# Altium project MODULIQ_PGA.PrjPcb (part 1 of 2)
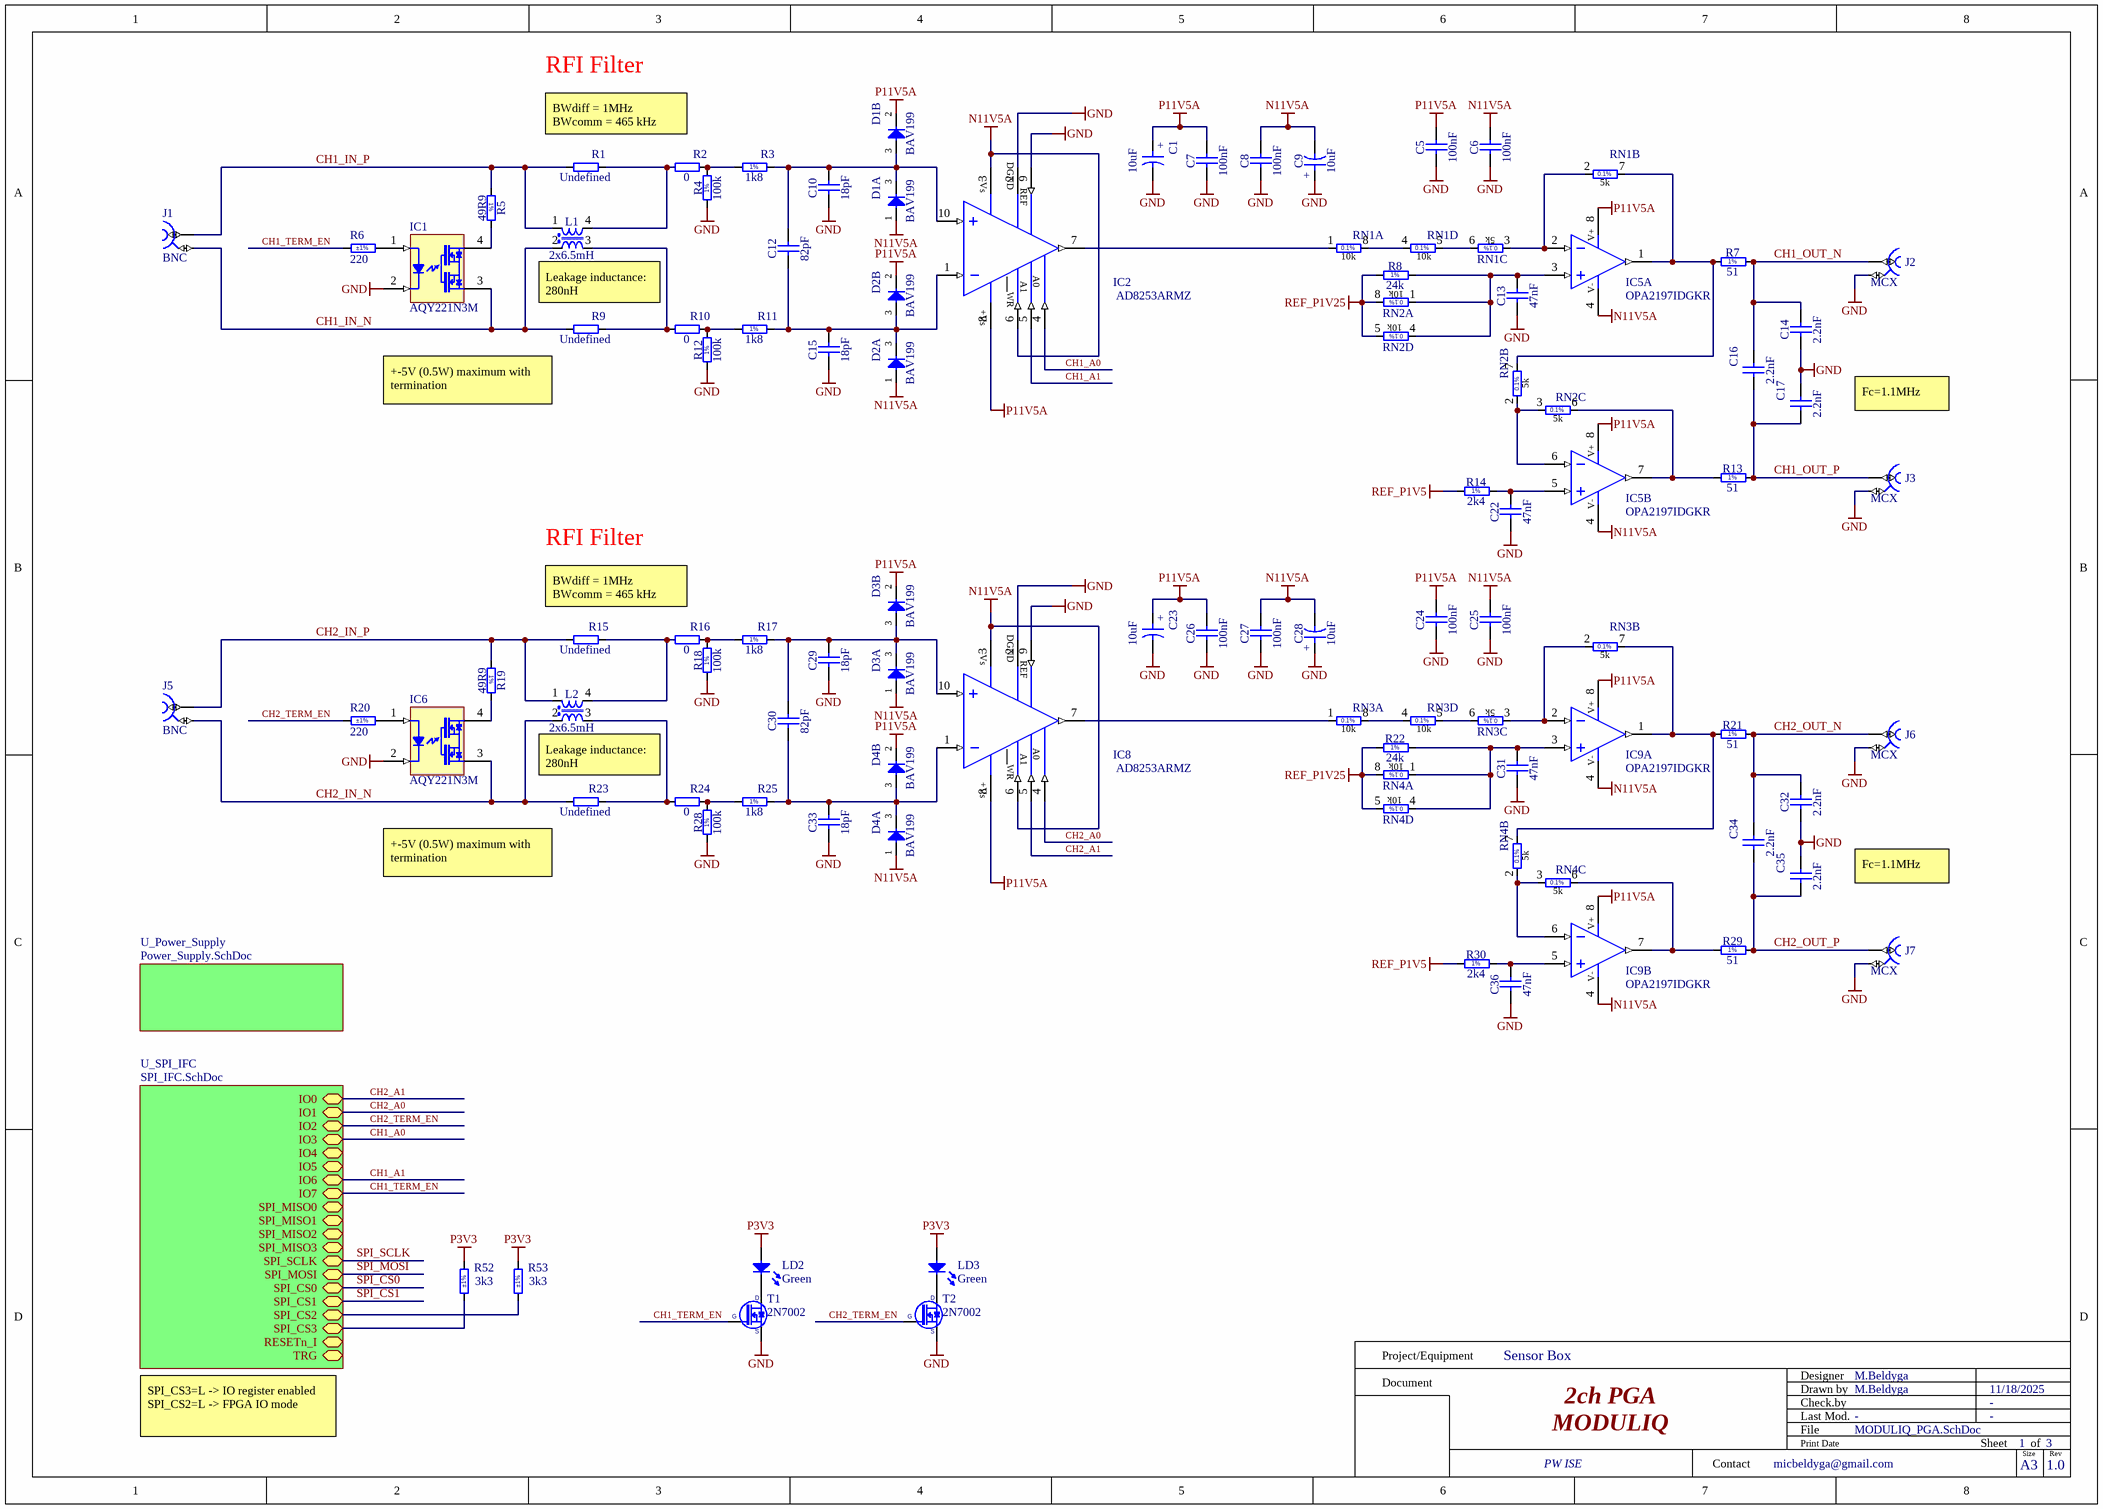
[diagram p0: MODULIQ_PGA.SchDoc]
Revision: 1.0; ProjectName: MODULIQ PGA; CreateDate: 11/18/2025
3 sheets, 187 parts. Net scope: hierarchical (ports join the sheet entries above them; power ports are global).
Board file: MODULIQ_PGA.PcbDoc
Sheets:
  MODULIQ_PGA.SchDoc
    U_SPI_IFC = SPI_IFC.SchDoc
    U_Power_Supply = Power_Supply.SchDoc

## Sheet MODULIQ_PGA.SchDoc: 2ch PGA
size A3; Author: M.Beldyga; CompanyName: WUT ISE; DrawnBy: M.Beldyga; Organization: WUT ISE; Address1: PW ISE; Address2: Nowowiejska 15/19 00-665 Warsaw; Address3: micbeldyga@gmail.com; SheetNumber: 1; SheetTotal: 3; ModifiedBy: -; CheckedDate: -; Title2: MODULIQ; DivGrp: WUT ISE; Designer: M.Beldyga; ModifiedDate: -; ProjectName: Sensor Box

### Parts
C1  10uF  [CAPMP3216X180N]
C5  100nF  [CAPC1005X55N]
C6  100nF  [CAPC1005X55N]
C7  100nF  [CAPC1005X55N]
C8  100nF  [CAPC1005X55N]
C9  10uF  [CAPMP3216X180N]
C10  18pF  [CAPC1608X87N]
C12  82pF  [CAPC2012X90N]
C13  47nF  [CAPC2012X135N]
C14  2.2nF  [CAPC2013X100N]
C15  18pF  [CAPC1608X87N]
C16  2.2nF  [CAPC2013X100N]
C17  2.2nF  [CAPC2013X100N]
C22  47nF  [CAPC2012X135N]
C23  10uF  [CAPMP3216X180N]
C24  100nF  [CAPC1005X55N]
C25  100nF  [CAPC1005X55N]
C26  100nF  [CAPC1005X55N]
C27  100nF  [CAPC1005X55N]
C28  10uF  [CAPMP3216X180N]
C29  18pF  [CAPC1608X87N]
C30  82pF  [CAPC2012X90N]
C31  47nF  [CAPC2012X135N]
C32  2.2nF  [CAPC2013X100N]
C33  18pF  [CAPC1608X87N]
C34  2.2nF  [CAPC2013X100N]
C35  2.2nF  [CAPC2013X100N]
C36  47nF  [CAPC2012X135N]
D1  BAV199  [SOT95P240X110-3N]  (parts A,B of 2)
D2  BAV199  [SOT95P240X110-3N]  (parts A,B of 2)
D3  BAV199  [SOT95P240X110-3N]  (parts A,B of 2)
D4  BAV199  [SOT95P240X110-3N]  (parts A,B of 2)
IC1  AQY221N3M  [PANASONIC_AQY22(SON)]
IC2  AD8253ARMZ  [SOP50P490X110-10N]
IC5  OPA2197IDGKR  [SOP65P490X110-8N]  (parts A,B of 2)
IC6  AQY221N3M  [PANASONIC_AQY22(SON)]
IC8  AD8253ARMZ  [SOP50P490X110-10N]
IC9  OPA2197IDGKR  [SOP65P490X110-8N]  (parts A,B of 2)
J1  BNC  [AMPHENOL_112515]
J2  MCX  [AMPHENOL_919-109J-51PX]
J3  MCX  [AMPHENOL_919-109J-51PX]
J5  BNC  [AMPHENOL_112515]
J6  MCX  [AMPHENOL_919-109J-51PX]
J7  MCX  [AMPHENOL_919-109J-51PX]
L1  2x6.5mH  [IND_WURTH_WE-SL2]
L2  2x6.5mH  [IND_WURTH_WE-SL2]
LD2  Green  [LED_KINGBRIGHT_KP-1608CGCK]
LD3  Green  [LED_KINGBRIGHT_KP-1608CGCK]
R1  Undefined  [RESC1608X55N]
R2  0  [RESC1608X55N]
R3  1k8  [RESC1608X55N]
R4  100k  [RESC1608X55N]
R5  49R9  [RESC6331X70N]
R6  220  Tolerance: ±1%  [RESC1005X40N]
R7  51  [RESC1005X40N]
R8  24k  [RESC1608X55N]
R9  Undefined  [RESC1608X55N]
R10  0  [RESC1608X55N]
R11  1k8  [RESC1608X55N]
R12  100k  [RESC1608X55N]
R13  51  [RESC1005X40N]
R14  2k4  [RESC1005X40N]
R15  Undefined  [RESC1608X55N]
R16  0  [RESC1608X55N]
R17  1k8  [RESC1608X55N]
R18  100k  [RESC1608X55N]
R19  49R9  [RESC6331X70N]
R20  220  Tolerance: ±1%  [RESC1005X40N]
R21  51  [RESC1005X40N]
R22  24k  [RESC1608X55N]
R23  Undefined  [RESC1608X55N]
R24  0  [RESC1608X55N]
R25  1k8  [RESC1608X55N]
R28  100k  [RESC1608X55N]
R29  51  [RESC1005X40N]
R30  2k4  [RESC1005X40N]
R52  3k3  Tolerance: ±1%  [RESC1005X40N]
R53  3k3  Tolerance: ±1%  [RESC1005X40N]
RN1  10k 5K 5K 10K  [SOIC127P600X175-8N]  (value not drawn)  (parts A,B,C,D of 4)
RN2  10k 5K 5K 10K  [SOIC127P600X175-8N]  (value not drawn)  (parts A,B,C,D of 4)
RN3  10k 5K 5K 10K  [SOIC127P600X175-8N]  (value not drawn)  (parts A,B,C,D of 4)
RN4  10k 5K 5K 10K  [SOIC127P600X175-8N]  (value not drawn)  (parts A,B,C,D of 4)
T1  2N7002  [SOT95P240X130-3N]
T2  2N7002  [SOT95P240X130-3N]

### Sub-sheets
U_Power_Supply = Power_Supply.SchDoc: no entries
U_SPI_IFC = SPI_IFC.SchDoc: IO0 (bidir), IO1 (bidir), IO2 (bidir), IO3 (bidir), IO4 (bidir), IO5 (bidir), IO6 (bidir), IO7 (bidir), SPI_MISO0 (bidir), SPI_MISO1 (bidir), SPI_MISO2 (bidir), SPI_MISO3 (bidir), SPI_SCLK (bidir), SPI_MOSI (bidir), SPI_CS0 (bidir), SPI_CS1 (bidir), SPI_CS2 (bidir), SPI_CS3 (bidir), RESETn_I (bidir), TRG (bidir)

### Nets
GND: C1.2 C5.1 C6.1 C7.1 C8.1 C9.1 C10.1 C13.1 C14.1 C15.1 C17.2 C22.1 C23.2 C24.1 C25.1 C26.1 C27.1 C28.1 C29.1 C31.1 C32.1 C33.1 C35.2 C36.1 IC1.2(K) IC2.2(DGND) IC2.9(REF) IC6.2(K) IC8.2(DGND) IC8.9(REF) J2.2 J3.2 J6.2 J7.2 R4.1 R12.1 R18.1 R28.1 T1.2(S) T2.2(S)
N11V5A: C6.2 C8.2 C9.2 C25.2 C27.2 C28.2 D1.1(A) D2.1(A) D3.1(A) D4.1(A) IC2.3(-VS) IC2.6(~{WR}) IC5.4(V-) IC8.3(-VS) IC8.6(~{WR}) IC9.4(V-)
P3V3: LD2.2(A) LD3.2(A) R52.1 R53.1
P11V5A: C1.1 C5.2 C7.2 C23.1 C24.2 C26.2 D1.2(C) D2.2(C) D3.2(C) D4.2(C) IC2.8(+VS) IC5.8(V+) IC8.8(+VS) IC9.8(V+)
REF_P1V5: R14.1 R30.1
REF_P1V25: R8.1 R22.1 RN2.5 RN2.8 RN4.5 RN4.8
CH1_A0: IC2.4(A0) ; sheet U_SPI_IFC/IO3
CH1_A1: IC2.5(A1) ; sheet U_SPI_IFC/IO6
CH1_IN_N: IC1.3(C) J1.2 L1.2 R9.1
CH1_IN_P: J1.1 L1.1 R1.1 R5.1
CH1_OUT_N: C14.2 C16.2 J2.1 R7.2
CH1_OUT_P: C16.1 C17.1 J3.1 R13.2
CH1_TERM_EN: R6.1 T1.1(G) ; sheet U_SPI_IFC/IO7
CH2_A0: IC8.4(A0) ; sheet U_SPI_IFC/IO1
CH2_A1: IC8.5(A1) ; sheet U_SPI_IFC/IO0
CH2_IN_N: IC6.3(C) J5.2 L2.2 R23.1
CH2_IN_P: J5.1 L2.1 R15.1 R19.1
CH2_OUT_N: C32.2 C34.2 J6.1 R21.2
CH2_OUT_P: C34.1 C35.1 J7.1 R29.2
CH2_TERM_EN: R20.1 T2.1(G) ; sheet U_SPI_IFC/IO2
SPI_CS2: R53.2 ; sheet U_SPI_IFC/SPI_CS2
SPI_CS3: R52.2 ; sheet U_SPI_IFC/SPI_CS3
NetC10_2: C10.2 C12.2 D1.3(COMAC) IC2.10(+IN) R3.2
NetC12_1: C12.1 C15.2 D2.3(COMAC) IC2.1(-IN) R11.2
NetC13_2: C13.2 IC5.3(IN+) R8.2 RN2.1 RN2.4
NetC22_2: C22.2 IC5.5(IN+) R14.2
NetC29_2: C29.2 C30.2 D3.3(COMAC) IC8.10(+IN) R17.2
NetC30_1: C30.1 C33.2 D4.3(COMAC) IC8.1(-IN) R25.2
NetC31_2: C31.2 IC9.3(IN+) R22.2 RN4.1 RN4.4
NetC36_2: C36.2 IC9.5(IN+) R30.2
NetIC1_1: IC1.1(A) R6.2
NetIC1_4: IC1.4(E) R5.2
NetIC2_7: IC2.7(OUT) RN1.1
NetIC5_1: IC5.1(OUT) R7.1 RN1.7 RN2.7
NetIC5_2: IC5.2(IN-) RN1.2 RN1.3
NetIC5_6: IC5.6(IN-) RN2.2 RN2.3
NetIC5_7: IC5.7(OUT) R13.1 RN2.6
NetIC6_1: IC6.1(A) R20.2
NetIC6_4: IC6.4(E) R19.2
NetIC8_7: IC8.7(OUT) RN3.1
NetIC9_1: IC9.1(OUT) R21.1 RN3.7 RN4.7
NetIC9_2: IC9.2(IN-) RN3.2 RN3.3
NetIC9_6: IC9.6(IN-) RN4.2 RN4.3
NetIC9_7: IC9.7(OUT) R29.1 RN4.6
NetL1_3: L1.3 R9.2 R10.1
NetL1_4: L1.4 R1.2 R2.1
NetL2_3: L2.3 R23.2 R24.1
NetL2_4: L2.4 R15.2 R16.1
NetLD2_1: LD2.1(C) T1.3(D)
NetLD3_1: LD3.1(C) T2.3(D)
NetR2_2: R2.2 R3.1 R4.2
NetR10_2: R10.2 R11.1 R12.2
NetR16_2: R16.2 R17.1 R18.2
NetR24_2: R24.2 R25.1 R28.2
NetRN1_4: RN1.4 RN1.8
NetRN1_5: RN1.5 RN1.6
NetRN3_4: RN3.4 RN3.8
NetRN3_5: RN3.5 RN3.6

### Notes on the sheet
- RFI Filter
- BWdiff = 1MHz
  BWcomm = 465 kHz
- (near L1) Leakage inductance: 280nH
- (near R9) +-5V (0.5W) maximum with termination
- Fc=1.1MHz
- (near L2) Leakage inductance: 280nH
- (near R23) +-5V (0.5W) maximum with termination
- SPI_CS3=L -> IO register enabled
  SPI_CS2=L -> FPGA IO mode
- Project/Equipment
- Document
- Designer
- Drawn by
- Check.by
- Contact
- File
- Last Mod.
- Print Date
- Sheet
- Size
- A3
- of
- Rev
- (in symbol AD8253ARMZ) -Vs; WR; +Vs
- (in symbol CTE3216-18_10UF_16V_20%_AVX_TCJ) +
- (in symbol R0402_2K4_1%_0.0625W_100PPM) 1%
- (in symbol R0402_51R_1%_0.0625W_100PPM) 1%
- (in symbol R0603_1K8_1%_0.1W_100PPM) 1%
- (in symbol R0603_24K_1%_0.1W_100PPM) 1%
- (in symbol R0603_100K_1%_0.1W_100PPM) 1%
- (in symbol R2512_49R9_1%_1W_100PPM_VISHAY_CRCW) 1%
- (in symbol RN_10K_5K_VISHAY_AORN2-1AT3, part A) 10k
- (in symbol RN_10K_5K_VISHAY_AORN2-1AT3, part B) 5k
- (in symbol RN_10K_5K_VISHAY_AORN2-1AT3, part C) 5k
- (in symbol RN_10K_5K_VISHAY_AORN2-1AT3, part D) 10k

### Library data of the parts
C1 C9 C23 C28 = CTE3216-18_10UF_16V_20%_AVX_TCJ: Polarised capacitor; Part Description: ESR 0R200 Tantalum Solid Electrolytic Chip Capacitor with Conductive Polymer Electrode; Manufacturer: AVX; Manufacturer Part Number: TCJA106M016R0200; Voltage: 16V; Tolerance: ±20%; Part Number: CTE3216-18_10UF_16V_20%_AVX_TCJ; Component Kind: Standard; Component Type: Standard; Pin Count: 2; Value: 10uF; Status: Preferred; Case: A; Mounted: Yes; Socket: No; SMD: Yes; Sense: No; ComponentHeight: 1.8mm; HelpURL: \\cern.ch\dfs\Applications\Altium\Datasheets\CTE_AVX_TCJ.pdf; Author: CERN DEM JLC; CreateDate: 29.03.2012; LatestRevisionDate: 29.03.2012
C5-C8 C24-C27 = CC0402_100NF_50V_10%_X7R: Non-polarised capacitor; Part Description: SMD Multilayer Chip Ceramic Capacitor; Manufacturer: GENERIC; Manufacturer1 Part Number: GRM155R71H104KE14D; Voltage: 50V; TC: X7R; Tolerance: ±10%; Part Number: CC0402_100NF_50V_10%_X7R; Component Kind: Standard; Component Type: Standard; Pin Count: 2; Value: 100nF; Status: None; Manufacturer Part Number: CC0402_100NF_50V_10%_X7R; Case: 0402; Mounted: Yes; Socket: No; SMD: Yes; Sense: No; Manufacturer1 Example: MURATA; Manufacturer1 ComponentHeight: 0.55mm; HelpURL: \\cern.ch\dfs\Applications\Altium\Datasheets\CC0402_MURATA_GRM155R71H104KE14D.pdf; Author: CERN DEM MR; CreateDate: 6/30/2017; LatestRevisionDate: 6/30/2017
C10 C15 C29 C33 = CC0603_18PF_50V_5%_NP0: Non-polarised capacitor; Part Description: SMD Multilayer Chip Ceramic Capacitor; Manufacturer: GENERIC; Manufacturer1 Part Number: 223886715189; Voltage: 50V; TC: C0G/NP0; Tolerance: ±5%; Part Number: CC0603_18PF_50V_5%_NP0; Component Kind: Standard; Component Type: Standard; Pin Count: 2; Value: 18pF; Status: Preferred; Manufacturer Part Number: CC0603_18PF_50V_5%_NP0; Case: 0603; Mounted: Yes; Socket: No; SMD: Yes; Sense: No; Manufacturer1 Example: PHYCOMP; Manufacturer1 ComponentHeight: 0.87mm; HelpURL: \\cern.ch\dfs\Applications\Altium\Datasheets\CC0603_NP0_PHYCOMP.pdf; Author: CERN DEM JLC; CreateDate: 03.12.2007; LatestRevisionDate: 03.12.2007
C12 C30 = CC0805_82PF_100V_1%_NP0_AVX_08051A820FAT2A: Non-polarised capacitor; Part Description: SMD Multilayer Chip Ceramic Capacitor; Manufacturer: AVX; Voltage: 100V; TC: NP0; Tolerance: ±1%; Part Number: CC0805_82PF_100V_1%_NP0_AVX_08051A820FAT2A; Component Kind: Standard; Component Type: Standard; Pin Count: 2; Value: 82pF; Status: Not Recommended; Manufacturer Part Number: 08051A820FAT2A; Case: 0805; Mounted: Yes; Socket: No; SMD: Yes; Sense: No; ComponentHeight: 0.9mm; HelpURL: \\cern.ch\dfs\Applications\Altium\Datasheets\CC0805_C0G_AVX.pdf; Author: CERN DEM WB; CreateDate: 26.07.2016; LatestRevisionDate: 26.07.2016
C13 C22 C31 C36 = CC0805_47NF_25V_5%_C0G: Non-polarised capacitor; Part Description: SMD Multilayer Chip Ceramic Capacitor; Manufacturer: GENERIC; Manufacturer1 Part Number: C0805C473J3GACTU; Voltage: 25V; TC: C0G/NP0; Tolerance: ±5%; Part Number: CC0805_47NF_25V_5%_C0G; Component Kind: Standard; Component Type: Standard; Pin Count: 2; Value: 47nF; Status: None; Manufacturer Part Number: CC0805_47NF_25V_5%_C0G; Case: 0805; Mounted: Yes; Socket: No; SMD: Yes; Sense: No; Manufacturer1 Example: KEMET; Manufacturer1 ComponentHeight: 1.4mm; HelpURL: \\cern.ch\dfs\Applications\Altium\Datasheets\CC0805_C0G_KEMET_(Commercial Grade).pdf; Author: CERN DEM JLC; CreateDate: 18.01.2011; LatestRevisionDate: 18.01.2011
C14 C16 C17 C32 C34 C35 = CC0805_2.2NF_25V_1%_C0G: Non-polarised capacitor; Part Description: SMD Multilayer Chip Ceramic Capacitor; Manufacturer: GENERIC; Manufacturer1 Part Number: C0805C222F3GACTU; Voltage: 25V; TC: C0G/NP0; Tolerance: ±1%; Part Number: CC0805_2.2NF_25V_1%_C0G; Component Kind: Standard; Component Type: Standard; Pin Count: 2; Value: 2.2nF; Status: None; Manufacturer Part Number: CC0805_2.2NF_25V_1%_C0G; Case: 0805; Mounted: Yes; Socket: No; SMD: Yes; Sense: No; Manufacturer1 Example: KEMET; Manufacturer1 ComponentHeight: 0.88mm; HelpURL: \\cern.ch\dfs\Applications\Altium\Datasheets\CC0805_C0G_KEMET_(Commercial Grade).pdf; Author: CERN DEM JLC; CreateDate: 11.03.2015; LatestRevisionDate: 11.03.2015
D1-D4 = BAV199: Serial Diode; Part Description: Low-Leakage Double Diode; Manufacturer: NXP SEMICONDUCTORS; Voltage: 75V; Power: 250mW; PressFit: No; Bonding: No; Part Number: BAV199; Component Kind: Standard; Component Type: Standard; Device: BAV199; PackageDescription: SOT23 3-Leads, Pitch 0.95mm - Body 1.4x3mm, IPC Medium Density; Manufacturer Part Number: BAV199; Pin Count: 3; Case: SOT23-3; Mounted: Yes; Socket: No; SMD: Yes; Sense: No; ComponentHeight: 1.1mm; HelpURL: \\cern.ch\dfs\Applications\Altium\Datasheets\BAV199.pdf; Author: CERN DEM JMW; CreateDate: 2008-11-21; LatestRevisionDate: 2008-11-21
IC1 IC6 = AQY221N3M: PhotoMOS Relay; Part Description: RF SON 1 Form A, PhotoMOS Relay, CxR5 (On Res. 5.5Ohm, Out Cap. 1.1pF), 25V 150mA; Manufacturer: PANASONIC; PressFit: No; Bonding: No; Part Number: AQY221N3M; Component Kind: Standard; Component Type: Standard; Device: AQY221N3M; PackageDescription: PANASONIC Serie AQY22(SON), 1.27mm Pitch; 4 Pin, 2.95mm W X 2.20mm L X 1.60mm H body; Manufacturer Part Number: AQY221N3M; Pin Count: 4; Case: SON4; Mounted: Yes; Socket: No; SMD: Yes; Sense: No; ComponentHeight: 1.4mm; HelpURL: \\cern.ch\dfs\Applications\Altium\Datasheets\AQY221N3M.pdf; ComponentLink1Description: Package Drawing; ComponentLink1URL: \\cern.ch\dfs\Applications\Altium\Datasheets\AQY22_Package-Drawing.pdf; Author: CERN DEM JLC; CreateDate: 1/18/2010; LatestRevisionDate: 12/5/2018
IC2 IC8 = AD8253ARMZ: 10MHz, 20V/us, G= 1, 10, 100, 1000 iCMOS Programmable Gain Instrumentation Amplifier; Manufacturer: ANALOG DEVICES; PressFit: No; Bonding: No; Part Number: AD8253ARMZ; Component Kind: Standard; Component Type: Standard; Device: AD8253ARMZ; PackageDescription: MSOP, 10-Leads, Body 3.1x3.1mm (max), Pitch 0.50mm, IPC Medium Density; Part Description: 10MHz, 20V/us, G= 1, 10, 100, 1000 iCMOS Programmable Gain Instrumentation Amplifier; Manufacturer Part Number: AD8253ARMZ; Pin Count: 8; Case: MSOP10; Mounted: Yes; Socket: No; SMD: Yes; Sense: No; ComponentHeight: 1.1mm; Author: CERN DEM JLC; HelpURL: \\cern.ch\dfs\Applications\Altium\Datasheets\AD8253ARMZ.pdf; CreateDate: 2013-10-02; LatestRevisionDate: 2013-10-02
IC5 IC9 = OA_OPA2197IDGKR: 36-V, Precision, Rail-to-Rail Input Output, Low Offset Voltage Op Amp 8-VSSOP; Part Description: High-Precision, Low-Noise, Rail-to-Rail Output,10-MHz Op Amp; Manufacturer: TEXAS INSTRUMENTS; PressFit: No; Bonding: No; Part Number: OPA2197IDGKR; Component Kind: Standard; Component Type: Standard; Device: OPA2197IDGKR; PackageDescription: SOP, 0.65mm pitch; 8 pin, 3.00mm W X 3.00mm L X 1.10mm H body, IPC Medium Density; Manufacturer Part Number: OPA2197IDGKR; Pin Count: 8; Case: MSOP8; Mounted: Yes; Socket: No; SMD: Yes; Sense: No; ComponentHeight: 1.1mm; Author: GK; HelpURL: \\cern.ch\dfs\Applications\Altium\Datasheets\OPA2140AIDGK.pdf; CreateDate: 20.04.2017; LatestRevisionDate: 20.04.2017
J1 J5 = AMPHENOL_112515: Part Description: 50 Ohms BNC Straight PCB Jack Through Hole; Manufacturer: AMPHENOL-RF; Manufacturer Part Number: 112515; PressFit: No; Part Number: AMPHENOL_112515; Component Kind: Standard; Component Type: Standard; Pin Count: 5; Family: BNC; Mounted: Yes; Socket: No; SMD: No; Sense: No; Status: None; ComponentHeight: 20mm; HelpURL: \\cern.ch\dfs\Applications\Altium\Datasheets\AMPHENOL-RF_112515.pdf; Author: CERN DEM HF; CreateDate: 6/28/2023; LatestRevisionDate: 6/28/2023
J2 J3 J6 J7 = AMPHENOL_919-109J-51PX: Part Description: 50 Ohms, RF Connector, MCX Straight PCB Receptacle Jack; Manufacturer Part Number: 919-109J-51PX (MCX6251B1-3GT30G-50); PressFit: No; Part Number: AMPHENOL_919-109J-51PX; Component Kind: Standard; Component Type: Standard; Pin Count: 5; Family: MCX; Mounted: Yes; Socket: No; SMD: No; Sense: No; Status: None; Manufacturer: AMPHENOL; ComponentHeight: 6.06mm; HelpURL: \\cern.ch\dfs\Applications\Altium\Datasheets\AMPHENOL_919-109J-51PX.pdf; Author: CERN DEM BC; CreateDate: 31.01.2019; LatestRevisionDate: 31.01.2019
L1 L2 = IND_6.5MH_50%_WURTH_WE-SL2-744229: Inductor Common Mode; Part Description: Common Mode SMD Line Filter (WE-SL2 Serie); Manufacturer: WURTH ELEKTRONIK; Manufacturer Part Number: 744229; Power: 400mA; Resistance: 0.95R; Tolerance: ±50%; Part Number: IND_6.5MH_50%_WURTH_WE-SL2-744229; Component Kind: Standard; Component Type: Standard; Pin Count: 4; Value: 2x6.5mH; Status: None; Mounted: Yes; Socket: No; SMD: Yes; Sense: No; ComponentHeight: 5.3mm; HelpURL: \\cern.ch\dfs\Applications\Altium\Datasheets\IND_WURTH_WE-SL2_744229.pdf; Author: CERN DEM JLC; CreateDate: 01.10.2012; LatestRevisionDate: 15.10.2012
LD2 LD3 = LED_KINGBRIGHT_KP-1608CGCK: LED Green 1C 2A; Part Description: 1.6x0.8mm SMD Chip Green LED Lamp; PressFit: No; Bonding: No; Part Number: LED_KINGBRIGHT_KP-1608CGCK; Component Kind: Standard; Component Type: Standard; Color: Green; PackageDescription: SMT Green LED, Case 0603, Body L 1.60mm x W 0.80mm x H 1.10mm; Manufacturer: KINGBRIGHT; Manufacturer Part Number: KP-1608CGCK; Pin Count: 2; Case: 0603; Mounted: Yes; Socket: No; SMD: Yes; Sense: No; ComponentHeight: 1.1mm; HelpURL: \\cern.ch\dfs\Applications\Altium\Datasheets\LED_KINGBRIGHT_KP-1608CGCK.pdf; Author: CERN DEM HF; CreateDate: 10/1/2021; LatestRevisionDate: 10/1/2021
R1 R9 R15 R23 = R0603_NO-VALUE: Resistor; Part Description: Reserved Footprint For a 0603 (1608) Chip Resistor; Mounted: No; Part Number: R0603_NO-VALUE; Component Kind: Standard; Component Type: Standard; Pin Count: 2; Value: Undefined; Status: None; Manufacturer: Undefined; Manufacturer Part Number: R0603_NO-VALUE; Case: 0603; Sense: No; Socket: No; SMD: Yes; Manufacturer1 Example: Undefined; Manufacturer1 Part Number: Undefined; Manufacturer1 ComponentHeight: Undefined; HelpURL: Undefined; Author: CERN DEM JLC; CreateDate: 03.12.2007; LatestRevisionDate: 13.03.2008
R2 R10 R16 R24 = R0603_0R_JUMPER: Resistor; Part Description: 1A (0.05R Max DC Resistance) Zero Ohm Jumper; Manufacturer: GENERIC; Manufacturer1 Part Number: NRC06Z0; Part Number: R0603_0R_JUMPER; Component Kind: Standard; Component Type: Standard; Pin Count: 2; Value: 0; Status: Preferred; Manufacturer Part Number: R0603_0R_JUMPER; Case: 0603; Mounted: Yes; Sense: No; Socket: No; SMD: Yes; Manufacturer1 Example: NIC COMPONENT; Manufacturer1 ComponentHeight: 0.55mm; HelpURL: \\cern.ch\dfs\Applications\Altium\Datasheets\R0603_NIC_NRC.pdf; Author: CERN DEM JLC; CreateDate: 03.12.2007; LatestRevisionDate: 13.03.2008
R3 R11 R17 R25 = R0603_1K8_1%_0.1W_100PPM: Resistor - 1%; Part Description: General Purpose Thick Film Chip Resistor; Manufacturer: GENERIC; Manufacturer1 Part Number: NRC06F1801TRF; Power: 0.1W; TC: ±100ppm/°C; Part Number: R0603_1K8_1%_0.1W_100PPM; Component Kind: Standard; Component Type: Standard; Pin Count: 2; Value: 1k8; Status: Preferred; Tolerance: ±1%; Manufacturer Part Number: R0603_1K8_1%_0.1W_100PPM; Case: 0603; Mounted: Yes; Sense: No; Socket: No; SMD: Yes; Manufacturer1 Example: NIC COMPONENT; Manufacturer1 ComponentHeight: 0.55mm; HelpURL: \\cern.ch\dfs\Applications\Altium\Datasheets\R0603_NIC_NRC.pdf; Author: CERN DEM JLC; CreateDate: 03.12.2007; LatestRevisionDate: 13.03.2008
R4 R12 R18 R28 = R0603_100K_1%_0.1W_100PPM: Resistor - 1%; Part Description: General Purpose Thick Film Chip Resistor; Manufacturer: GENERIC; Manufacturer1 Part Number: NRC06F1003TRF; Power: 0.1W; TC: ±100ppm/°C; Part Number: R0603_100K_1%_0.1W_100PPM; Component Kind: Standard; Component Type: Standard; Pin Count: 2; Value: 100k; Status: Preferred; Tolerance: ±1%; Manufacturer Part Number: R0603_100K_1%_0.1W_100PPM; Case: 0603; Mounted: Yes; Sense: No; Socket: No; SMD: Yes; Manufacturer1 Example: NIC COMPONENT; Manufacturer1 ComponentHeight: 0.55mm; HelpURL: \\cern.ch\dfs\Applications\Altium\Datasheets\R0603_NIC_NRC.pdf; Author: CERN DEM JLC; CreateDate: 03.12.2007; LatestRevisionDate: 13.03.2008
R5 R19 = R2512_49R9_1%_1W_100PPM_VISHAY_CRCW: Resistor - 1%; Part Description: Thick Film Chip Resistor; Manufacturer: VISHAY DRALORIC; Manufacturer Part Number: CRCW251249R9FKEG; Power: 1W; TC: ±100ppm/°C; PressFit: No; Part Number: R2512_49R9_1%_1W_100PPM_VISHAY_CRCW; Component Kind: Standard; Component Type: Standard; Pin Count: 2; Value: 49R9; Status: None; Tolerance: ±1%; Case: 2512; Mounted: Yes; Sense: No; Socket: No; SMD: Yes; ComponentHeight: 0.7mm; HelpURL: \\cern.ch\dfs\Applications\Altium\Datasheets\R2512_VISHAY_CRCW2512.pdf; Author: CERN DEM JLC; CreateDate: 22.05.2012; LatestRevisionDate: 22.05.2012
R6 R20 = R0402_220R_1%_0.0625W_100PPM: Resistor - 1%; Part Description: General Purpose Thick Film Chip Resistor; Manufacturer: GENERIC; Manufacturer1 Part Number: 232270672201L; TC: ±100ppm/°C; PressFit: No; Part Number: R0402_220R_1%_0.0625W_100PPM; Component Kind: Standard; Component Type: Standard; Pin Count: 2; Value: 220; Status: Not Recommended; Power: 0.0625W; Manufacturer Part Number: R0402_220R_1%_0.0625W_100PPM; Case: 0402; Mounted: Yes; Sense: No; Socket: No; SMD: Yes; Manufacturer1 Example: YAGEO PHYCOMP; Manufacturer1 ComponentHeight: 0.4mm; HelpURL: \\cern.ch\dfs\Applications\Altium\Datasheets\R0402_Phycomp_RC0402.pdf; Author: CERN DEM JLC; CreateDate: 12/3/2007; LatestRevisionDate: 10/17/2012
R7 R13 R21 R29 = R0402_51R_1%_0.0625W_100PPM: Resistor - 1%; Part Description: General Purpose Thick Film Chip Resistor; Manufacturer: GENERIC; Manufacturer1 Part Number: 232270675109L; TC: ±100ppm/°C; PressFit: No; Part Number: R0402_51R_1%_0.0625W_100PPM; Component Kind: Standard; Component Type: Standard; Pin Count: 2; Value: 51; Status: Not Recommended; Power: 0.0625W; Tolerance: ±1%; Manufacturer Part Number: R0402_51R_1%_0.0625W_100PPM; Case: 0402; Mounted: Yes; Sense: No; Socket: No; SMD: Yes; Manufacturer1 Example: YAGEO PHYCOMP; Manufacturer1 ComponentHeight: 0.4mm; HelpURL: \\cern.ch\dfs\Applications\Altium\Datasheets\R0402_Phycomp_RC0402.pdf; Author: CERN DEM JLC; CreateDate: 03.12.2007; LatestRevisionDate: 17.10.2012
R8 R22 = R0603_24K_1%_0.1W_100PPM: Resistor - 1%; Part Description: General Purpose Thick Film Chip Resistor; Manufacturer: GENERIC; Manufacturer1 Part Number: NRC06F2402TRF; Power: 0.1W; TC: ±100ppm/°C; PressFit: No; Part Number: R0603_24K_1%_0.1W_100PPM; Component Kind: Standard; Component Type: Standard; Pin Count: 2; Value: 24k; Status: Preferred; Tolerance: ±1%; Manufacturer Part Number: R0603_24K_1%_0.1W_100PPM; Case: 0603; Mounted: Yes; Sense: No; Socket: No; SMD: Yes; Manufacturer1 Example: NIC COMPONENT; Manufacturer1 ComponentHeight: 0.55mm; HelpURL: \\cern.ch\dfs\Applications\Altium\Datasheets\R0603_NIC_NRC.pdf; Author: CERN DEM JLC; CreateDate: 03.12.2007; LatestRevisionDate: 13.03.2008
R14 R30 = R0402_2K4_1%_0.0625W_100PPM: Resistor - 1%; Part Description: General Purpose Thick Film Chip Resistor; Manufacturer: GENERIC; Manufacturer1 Part Number: 232270672402L; TC: ±100ppm/°C; PressFit: No; Part Number: R0402_2K4_1%_0.0625W_100PPM; Component Kind: Standard; Component Type: Standard; Pin Count: 2; Value: 2k4; Status: Not Recommended; Power: 0.0625W; Tolerance: ±1%; Manufacturer Part Number: R0402_2K4_1%_0.0625W_100PPM; Case: 0402; Mounted: Yes; Sense: No; Socket: No; SMD: Yes; Manufacturer1 Example: YAGEO PHYCOMP; Manufacturer1 ComponentHeight: 0.4mm; HelpURL: \\cern.ch\dfs\Applications\Altium\Datasheets\R0402_Phycomp_RC0402.pdf; Author: CERN DEM JLC; CreateDate: 03.12.2007; LatestRevisionDate: 17.10.2012
R52 R53 = R0402_3K3_1%_0.0625W_100PPM: Resistor - 1%; Part Description: General Purpose Thick Film Chip Resistor; Manufacturer: GENERIC; Manufacturer1 Part Number: 232270673302L; TC: ±100ppm/°C; PressFit: No; Part Number: R0402_3K3_1%_0.0625W_100PPM; Component Kind: Standard; Component Type: Standard; Pin Count: 2; Value: 3k3; Status: Not Recommended; Power: 0.0625W; Manufacturer Part Number: R0402_3K3_1%_0.0625W_100PPM; Case: 0402; Mounted: Yes; Sense: No; Socket: No; SMD: Yes; Manufacturer1 Example: YAGEO PHYCOMP; Manufacturer1 ComponentHeight: 0.4mm; HelpURL: \\cern.ch\dfs\Applications\Altium\Datasheets\R0402_Phycomp_RC0402.pdf; Author: CERN DEM JLC; CreateDate: 03.12.2007; LatestRevisionDate: 17.10.2012
RN1-RN4 = RN_10K_5K_VISHAY_AORN2-1AT3: DIL8 Resistor Network 4 Resistors 10k-5k-5k-10k 0.1%; Part Description: Dual-In-Line Thin Film Precision Automotive Resistors Network, (4 Isolated) - AORN Series; Manufacturer: VISHAY DALE; Power: 4x0.1W; TC: ±25ppm/°C; PressFit: No; Part Number: RN_10K_5K_VISHAY_AORN2-1AT3; Component Kind: Standard; Component Type: Standard; Pin Count: 8; Value: 10k 5K 5K 10K; Sense: No; Tolerance: 0.1%; Manufacturer Part Number: AORN2-1AT3; Case: SOIC8; Mounted: Yes; Socket: No; SMD: Yes; ComponentHeight: 1.73mm; HelpURL: \\cern.ch\dfs\Applications\Altium\Datasheets\RN_VISHAY_AORN.pdf; Author: CERN DEM JLC; CreateDate: 20.02.2017; LatestRevisionDate: 20.02.2017
T1 T2 = 2N7002: N-CHANNEL MOSFET WITH DIODE; Part Description: 60V, 280mA, N-Channel Enhancement Mode Field Effect Transistor (FET); Manufacturer: FAIRCHILD SEMICONDUCTOR; PressFit: No; Bonding: No; Part Number: 2N7002; Component Kind: Standard; Component Type: Standard; Device: 2N7002; PackageDescription: SOT23, 0.95mm Pitch; 3 Pin, 1.30mm W X 2.90mm L X 1.30mm H body, IPC Medium Density; Manufacturer Part Number: 2N7002; Pin Count: 3; Case: SOT23-3; Mounted: Yes; Socket: No; SMD: Yes; Sense: No; ComponentHeight: 1.3mm; HelpURL: \\cern.ch\dfs\Applications\Altium\Datasheets\2N7002.pdf; Author: CERN DEM JLC; CreateDate: 8/20/2008; LatestRevisionDate: 4/7/2009

## Sheet SPI_IFC.SchDoc: Title
size 420 x 297 mm; Author: G.Kasprowicz; CompanyName: WUT ISE; DrawnBy: G.Kasprowicz; Organization: WUT ISE; Address1: PW ISE; Address2: Nowowiejska 15/19 00-665 Warsaw; Address3: gkasprow@gmail.com; Revision: 1.0; SheetNumber: 2; SheetTotal: 3; ModifiedBy: -; CheckedDate: -; Title2: Title2; DivGrp: WUT ISE; Designer: G.Kasprowicz; SPICEModelCacheRYPVXPCY: <root> / <DocumentId>RYPVXPCY</DocumentId> / </root>; ModifiedDate: -; ProjectName: Sensor Box
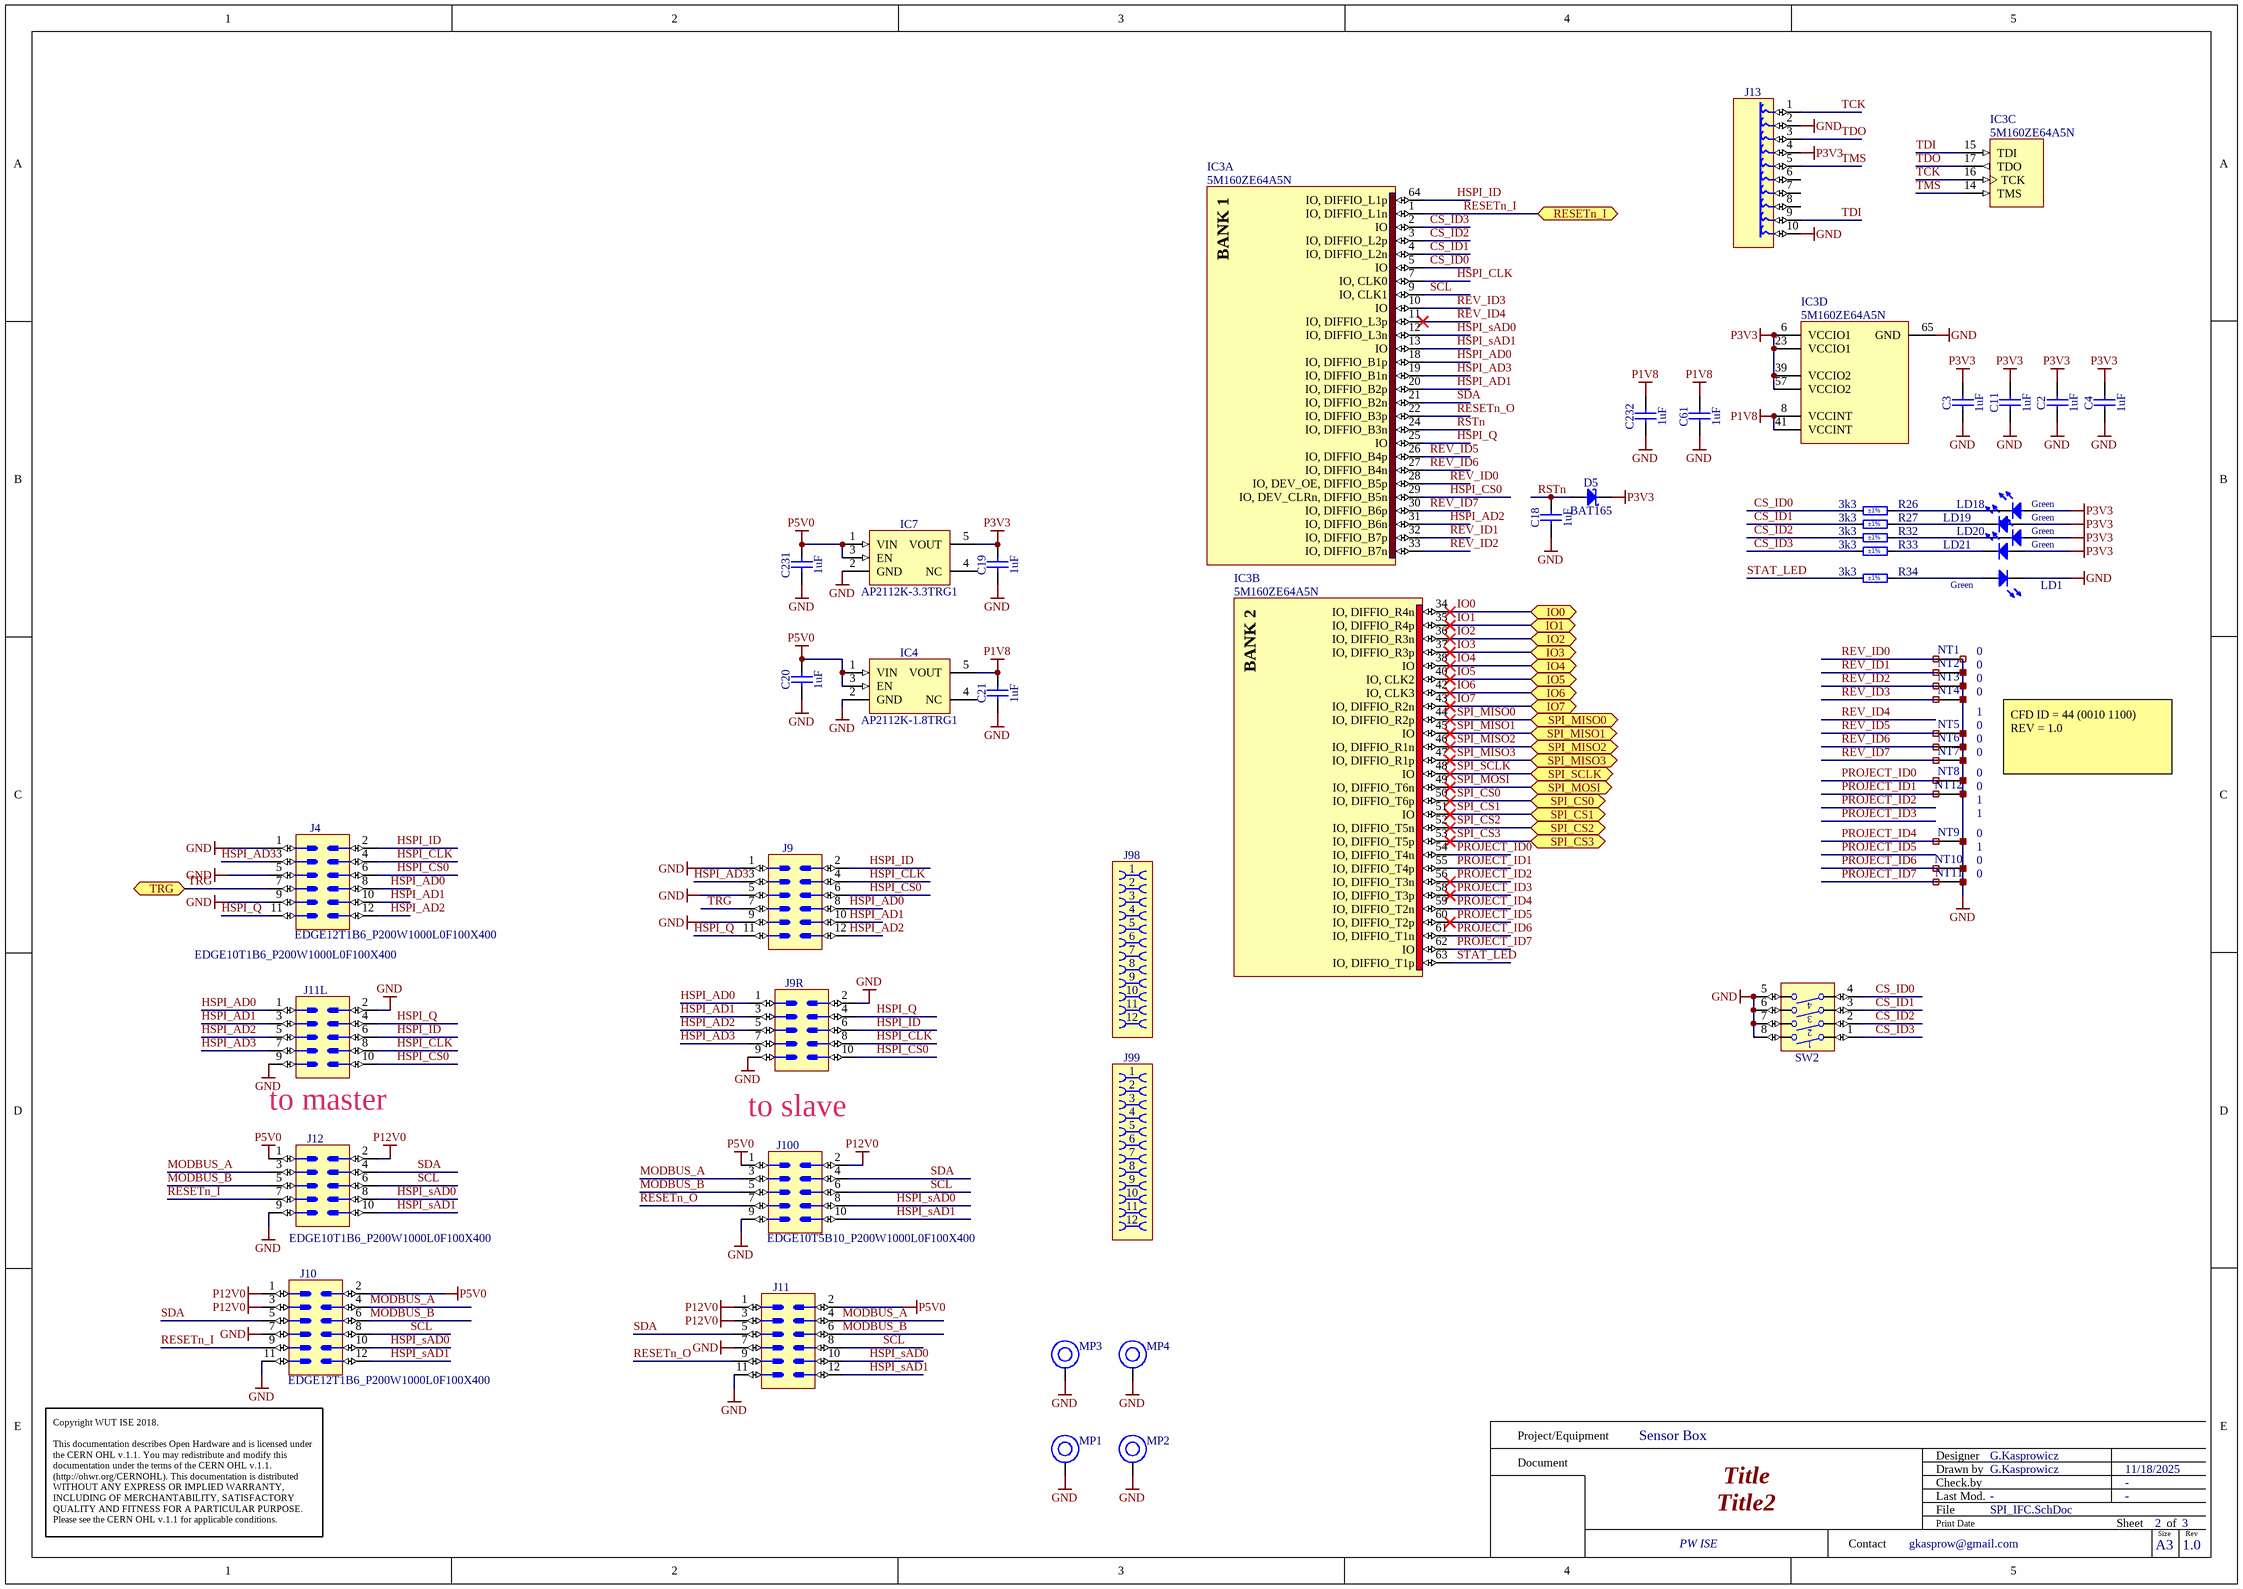
[diagram p1: SPI_IFC.SchDoc]

### Parts
C2  1uF  [CAPC1005X55N]
C3  1uF  [CAPC1005X55N]
C4  1uF  [CAPC1005X55N]
C11  1uF  [CAPC1005X55N]
C18  1uF  [CAPC1005X55N]
C19  1uF  [CAPC1005X55N]
C20  1uF  [CAPC1005X55N]
C21  1uF  [CAPC1005X55N]
C61  1uF  [CAPC1005X55N]
C231  1uF  [CAPC1005X55N]
C232  1uF  [CAPC1005X55N]
D5  BAT165  [SOD2512X110N]
IC3  5M160ZE64A5N  [QFP40P900X900X120-65N-S550]  (parts A,B,C,D of 4)
IC4  AP2112K-1.8TRG1  [SOT95P285X140-5N]
IC7  AP2112K-3.3TRG1  [SOT95P285X140-5N]
J4  (no value)  [EDGE12T1B6_P200W1000L0F100X400]
J9  (no value)  [EDGE12T5B10_P200W1000L0F100X400]
J9R  (no value)  [EDGE10T5B10_P200W1000L0F100X400]
J10  (no value)  [EDGE12T1B6_P200W1000L0F100X400]
J11  (no value)  [EDGE12T5B10_P200W1000L0F100X400]
J11L  (no value)  [EDGE10T1B6_P200W1000L0F100X400]
J12  (no value)  [EDGE10T1B6_P200W1000L0F100X400]
J13  TC2050-IDC  [TC2050-IDC]  (value not drawn)
J98  (no value)  [AVX_009159012761916]
J99  (no value)  [AVX_009159012761916]
J100  (no value)  [EDGE10T5B10_P200W1000L0F100X400]
LD1  Green  [LED_KINGBRIGHT_KP-1608CGCK]
LD18  Green  [LED_KINGBRIGHT_KP-1608CGCK]
LD19  Green  [LED_KINGBRIGHT_KP-1608CGCK]
LD20  Green  [LED_KINGBRIGHT_KP-1608CGCK]
LD21  Green  [LED_KINGBRIGHT_KP-1608CGCK]
MP1  M1.6 x 3mm  [97730306330]  (value not drawn)
MP2  M1.6 x 3mm  [97730306330]  (value not drawn)
MP3  M1.6 x 3mm  [97730306330]  (value not drawn)
MP4  M1.6 x 3mm  [97730306330]  (value not drawn)
NT1  Net Tie  [Net Tie 3]  (value not drawn)  (net tie, no BOM)
NT2  Net Tie  [Net Tie 3]  (value not drawn)  (net tie, no BOM)
NT3  Net Tie  [Net Tie 3]  (value not drawn)  (net tie, no BOM)
NT4  Net Tie  [Net Tie 3]  (value not drawn)  (net tie, no BOM)
NT5  Net Tie  [Net Tie 3]  (value not drawn)  (net tie, no BOM)
NT6  Net Tie  [Net Tie 3]  (value not drawn)  (net tie, no BOM)
NT7  Net Tie  [Net Tie 3]  (value not drawn)  (net tie, no BOM)
NT8  Net Tie  [Net Tie 3]  (value not drawn)  (net tie, no BOM)
NT9  Net Tie  [Net Tie 3]  (value not drawn)  (net tie, no BOM)
NT10  Net Tie  [Net Tie 3]  (value not drawn)  (net tie, no BOM)
NT11  Net Tie  [Net Tie 3]  (value not drawn)  (net tie, no BOM)
NT12  Net Tie  [Net Tie 3]  (value not drawn)  (net tie, no BOM)
R26  3k3  Tolerance: ±1%  [RESC1005X40N]
R27  3k3  Tolerance: ±1%  [RESC1005X40N]
R32  3k3  Tolerance: ±1%  [RESC1005X40N]
R33  3k3  Tolerance: ±1%  [RESC1005X40N]
R34  3k3  Tolerance: ±1%  [RESC1005X40N]
SW2  Switch  [SW_OMRON_A6H-4102]  (value not drawn)

### Ports
IO0 (bidir), IO1 (bidir), IO2 (bidir), IO3 (bidir), IO4 (bidir), IO5 (bidir), IO6 (bidir), IO7 (bidir), RESETn_I (bidir), SPI_CS0 (bidir), SPI_CS1 (bidir), SPI_CS2 (bidir), SPI_CS3 (bidir), SPI_MISO0 (bidir), SPI_MISO1 (bidir), SPI_MISO2 (bidir), SPI_MISO3 (bidir), SPI_MOSI (bidir), SPI_SCLK (bidir), TRG (bidir)

### Nets
GND: C2.1 C3.1 C4.1 C11.1 C18.1 C19.1 C20.1 C21.1 C61.1 C231.1 C232.1 IC3.65(GND) IC4.2(GND) IC7.2(GND) J4.1 J4.5 J4.9 J9.1 J9.5 J9.9 J9R.2 J9R.9 J10.7 J10.11 J11.7 J11.11 J11L.2 J11L.9 J12.9 J13.2 J13.10 J100.9 LD1.1(C) MP1.1 MP2.1 MP3.1 MP4.1 NT1.2 NT2.2 NT3.2 NT4.2 NT5.2 NT6.2 NT7.2 NT8.2 NT9.2 NT10.2 NT11.2 NT12.2 SW2.5 SW2.6 SW2.7 SW2.8
P1V8: C21.2 C61.2 C232.2 IC3.8(VCCINT) IC3.41(VCCINT) IC4.5(VOUT)
P3V3: C2.2 C3.2 C4.2 C11.2 C19.2 D5.1(C) IC3.6(VCCIO1) IC3.23(VCCIO1) IC3.39(VCCIO2) IC3.57(VCCIO2) IC7.5(VOUT) J13.4 LD18.2(A) LD19.2(A) LD20.2(A) LD21.2(A)
P5V0: C20.2 C231.2 IC4.1(VIN) IC4.3(EN) IC7.1(VIN) IC7.3(EN) J10.2 J11.2 J12.1 J100.1
P12V0: J10.1 J10.3 J11.1 J11.3 J12.2 J100.2
CS_ID0: IC3.5(IO) R26.2 SW2.4
CS_ID1: IC3.4(IO,_DIFFIO_L2n) R27.2 SW2.3
CS_ID2: IC3.3(IO,_DIFFIO_L2p) R32.2 SW2.2
CS_ID3: IC3.2(IO) R33.2 SW2.1
HSPI_AD0: IC3.18(IO,_DIFFIO_B1p) J4.8 J9.8 J9R.1 J11L.1
HSPI_AD1: IC3.20(IO,_DIFFIO_B2p) J4.10 J9.10 J9R.3 J11L.3
HSPI_AD2: IC3.31(IO,_DIFFIO_B6n) J4.12 J9.12 J9R.5 J11L.5
HSPI_AD3: IC3.19(IO,_DIFFIO_B1n) J4.3 J9.3 J9R.7 J11L.7
HSPI_CLK: IC3.7(IO,_CLK0) J4.4 J9.4 J9R.8 J11L.8
HSPI_CS0: IC3.29(IO,_DEV_CLRn,_DIFFIO_B5n) J4.6 J9.6 J9R.10 J11L.10
HSPI_ID: IC3.64(IO,_DIFFIO_L1p) J4.2 J9.2 J9R.6 J11L.6
HSPI_Q: IC3.25(IO) J4.11 J9.11 J9R.4 J11L.4
HSPI_sAD0: IC3.12(IO,_DIFFIO_L3n) J10.10 J11.10 J12.8 J100.8
HSPI_sAD1: IC3.13(IO) J10.12 J11.12 J12.10 J100.10
IO0: IC3.34(IO,_DIFFIO_R4n) ; port IO0  [project net CH2_A1]
IO1: IC3.35(IO,_DIFFIO_R4p) ; port IO1  [project net CH2_A0]
IO2: IC3.36(IO,_DIFFIO_R3n) ; port IO2  [project net CH2_TERM_EN]
IO3: IC3.37(IO,_DIFFIO_R3p) ; port IO3  [project net CH1_A0]
IO4: IC3.38(IO) ; port IO4
IO5: IC3.40(IO,_CLK2) ; port IO5
IO6: IC3.42(IO,_CLK3) ; port IO6  [project net CH1_A1]
IO7: IC3.43(IO,_DIFFIO_R2n) ; port IO7  [project net CH1_TERM_EN]
MODBUS_A: J10.4 J11.4 J12.3 J100.3
MODBUS_B: J10.6 J11.6 J12.5 J100.5
PROJECT_ID0: IC3.54(IO,_DIFFIO_T4n) NT8.1
PROJECT_ID1: IC3.55(IO,_DIFFIO_T4p) NT12.1
PROJECT_ID2: IC3.56(IO,_DIFFIO_T3n)
PROJECT_ID3: IC3.58(IO,_DIFFIO_T3p)
PROJECT_ID4: IC3.59(IO,_DIFFIO_T2n) NT9.1
PROJECT_ID5: IC3.60(IO,_DIFFIO_T2p)
PROJECT_ID6: IC3.61(IO,_DIFFIO_T1n) NT10.1
PROJECT_ID7: IC3.62(IO) NT11.1
RESETn_I: IC3.1(IO,_DIFFIO_L1n) J10.9 J12.7 ; port RESETn_I
RESETn_O: IC3.22(IO,_DIFFIO_B3p) J11.9 J100.7
REV_ID0: IC3.28(IO,_DEV_OE,_DIFFIO_B5p) NT1.1
REV_ID1: IC3.32(IO,_DIFFIO_B7p) NT2.1
REV_ID2: IC3.33(IO,_DIFFIO_B7n) NT3.1
REV_ID3: IC3.10(IO) NT4.1
REV_ID4: IC3.11(IO,_DIFFIO_L3p)
REV_ID5: IC3.26(IO,_DIFFIO_B4p) NT5.1
REV_ID6: IC3.27(IO,_DIFFIO_B4n) NT6.1
REV_ID7: IC3.30(IO,_DIFFIO_B6p) NT7.1
RSTn: C18.2 D5.2(A) IC3.24(IO,_DIFFIO_B3n)
SCL: IC3.9(IO,_CLK1) J10.8 J11.8 J12.6 J100.6
SDA: IC3.21(IO,_DIFFIO_B2n) J10.5 J11.5 J12.4 J100.4
SPI_CS0: IC3.50(IO,_DIFFIO_T6p) ; port SPI_CS0
SPI_CS1: IC3.51(IO) ; port SPI_CS1
SPI_CS2: IC3.52(IO,_DIFFIO_T5n) ; port SPI_CS2
SPI_CS3: IC3.53(IO,_DIFFIO_T5p) ; port SPI_CS3
SPI_MISO0: IC3.44(IO,_DIFFIO_R2p) ; port SPI_MISO0
SPI_MISO1: IC3.45(IO) ; port SPI_MISO1
SPI_MISO2: IC3.46(IO,_DIFFIO_R1n) ; port SPI_MISO2
SPI_MISO3: IC3.47(IO,_DIFFIO_R1p) ; port SPI_MISO3
SPI_MOSI: IC3.49(IO,_DIFFIO_T6n) ; port SPI_MOSI
SPI_SCLK: IC3.48(IO) ; port SPI_SCLK
STAT_LED: IC3.63(IO,_DIFFIO_T1p) R34.2
TCK: IC3.16(TCK) J13.1
TDI: IC3.15(TDI) J13.9
TDO: IC3.17(TDO) J13.3
TMS: IC3.14(TMS) J13.5
TRG: J4.7 J9.7 ; port TRG
NetLD1_2: LD1.2(A) R34.1
NetLD18_1: LD18.1(C) R26.1
NetLD19_1: LD19.1(C) R27.1
NetLD20_1: LD20.1(C) R32.1
NetLD21_1: LD21.1(C) R33.1

Not connected (* = marked no-connect by the designer): IC4 4(NC); IC7 4(NC); J13 6 7 8

### Notes on the sheet
- 0
- 1
- CFD ID = 44 (0010 1100)
  REV = 1.0
- (near J11L) to master
- to slave
- Project/Equipment
- Document
- Designer
- Drawn by
- Check.by
- Copyright WUT ISE 2018.
  This documentation describes Open Hardware and is licensed under the CERN OHL v.1.1. You may redistribute and modify this documentation under the terms of the CERN OHL v.1.1. (http://ohwr.org/CERNOHL). This documentation is distributed WITHOUT ANY EXPRESS OR IMPLIED WARRANTY, INCLUDING OF MERCHANTABILITY, SATISFACTORY QUALITY AND FITNESS FOR A PARTICULAR PURPOSE. Please see the CERN OHL v.1.1 for applicable conditions.
- Contact
- File
- Last Mod.
- Print Date
- Sheet
- Size
- A3
- of
- Rev
- (in symbol 5M160ZE64A5N, part A) BANK 1
- (in symbol 5M160ZE64A5N, part B) BANK 2
- (in symbol AVX_009159012761916) 11

### Library data of the parts
C2-C4 C11 C18-C21 C61 C231 C232 = CC0402_1UF_16V_10%_X5R: Non-polarised capacitor; Part Description: SMD Multilayer Chip Ceramic Capacitor; Manufacturer: GENERIC; Manufacturer1 Part Number: C1005X5R1C105KT; Voltage: 16V; TC: X5R; Tolerance: ±10%; Part Number: CC0402_1UF_16V_10%_X5R; Component Kind: Standard; Component Type: Standard; Pin Count: 2; Value: 1uF; Status: Preferred; Manufacturer Part Number: CC0402_1UF_16V_10%_X5R; Case: 0402; Mounted: Yes; Socket: No; SMD: Yes; Sense: No; Manufacturer1 Example: TDK; Manufacturer1 ComponentHeight: 0.55mm; HelpURL: \\cern.ch\dfs\Applications\Altium\Datasheets\CC0402_X5R_TDK_C.pdf; Author: CERN DEM JLC; CreateDate: 25.10.2012; LatestRevisionDate: 25.10.2012
D5 = BAT165: Schottky Diode; Part Description: Medium Power AF Schottky Diode; Manufacturer: INFINEON; Voltage: 40V; Power: 750mA; PressFit: No; Bonding: No; Part Number: BAT165; Component Kind: Standard; Component Type: Standard; Device: BAT165; PackageDescription: Small Outline Diode (SOD-323), 1.70mm W X 1.25mm L X 1.10mm H body,  IPC Medium Density; Manufacturer Part Number: BAT165; Pin Count: 2; Case: SOD-323; Mounted: Yes; Socket: No; SMD: Yes; Sense: No; ComponentHeight: 1.1mm; HelpURL: \\cern.ch\dfs\Applications\Altium\Datasheets\BAT165.pdf; Author: CERN DEM JLC; CreateDate: 12.11.2014; LatestRevisionDate: 12.11.2014
IC3 = 5M160ZE64A5N: MAX V 1.8V CPLD, 54 IOs, 160 Logic Elements, 64-Pin EQFP, Automotive Temperature, Speed Grade 5, Pb-Free; Manufacturer: ALTERA; PressFit: No; Bonding: No; Part Number: 5M160ZE64A5N; Component Kind: Standard; Component Type: Standard; Device: 5M160ZE64A5N; PackageDescription: QFP, 0.40mm Pitch, Square; 64 pin, 7.00mm L X 7.00mm W X 1.20mm H body (w/Thermal Tab 5.50 X 5.50mm), IPC Medium Density; Status: Not Recommended; Part Description: MAX V 1.8V CPLD, 54 IOs, 160 Logic Elements, 64-Pin EQFP, Automotive Temperature, Speed Grade 5, Pb-Free; Manufacturer Part Number: 5M160ZE64A5N; Pin Count: 65; Case: QFP64; Mounted: Yes; Socket: No; SMD: Yes; Sense: No; ComponentHeight: 1.2mm; HelpURL: \\cern.ch\dfs\Applications\Altium\Datasheets\5M160ZE64A5N.pdf; ComponentLink1URL: \\cern.ch\dfs\Applications\Altium\Datasheets\5M160ZE64A5N_Package.pdf; ComponentLink1Description: Package Drawing; ComponentLink2URL: \\cern.ch\dfs\Applications\Altium\Datasheets\5M160ZE64A5N_Pinout.pdf; ComponentLink2Description: Pinout; Author: CERN DEM JLC; CreateDate: 07.01.2015; LatestRevisionDate: 27.10.2022
IC4 = AP2112K-1.8TRG1: 600mA CMOS Low Dropout Linear Regulator with Enable; Part Description: 1.8V 600mA CMOS Low Dropout Linear Regulator with Enable; Manufacturer: DIODES INCORPORATED; PressFit: No; Bonding: No; Part Number: AP2112K-1.8TRG1; Component Kind: Standard; Component Type: Standard; Device: AP2112K-1.8TRG1; PackageDescription: SOT23, 0.95mm Pitch; 5 Pin, 1.6mm W X 3.0mm L X 1.40mm H body, IPC Medium Density; Manufacturer Part Number: AP2112K-1.8; Pin Count: 5; Case: SOT25; Mounted: Yes; Socket: No; SMD: Yes; Sense: No; ComponentHeight: 1.4mm; HelpURL: \\cern.ch\dfs\Applications\Altium\Datasheets\AP2112K-1.8TRG1.pdf; Author: CERN DEM JLC; CreateDate: 13.06.2018; LatestRevisionDate: 27.06.2022
IC7 = AP2112K-3.3TRG1: 600mA CMOS Low Dropout Linear Regulator with Enable; Part Description: 3.3V 600mA CMOS Low Dropout Linear Regulator with Enable; Manufacturer: DIODES INCORPORATED; PressFit: No; Bonding: No; Part Number: AP2112K-3.3TRG1; Component Kind: Standard; Component Type: Standard; Device: AP2112K-3.3TRG1; PackageDescription: SOT23, 0.95mm Pitch; 5 Pin, 1.6mm W X 3.0mm L X 1.40mm H body, IPC Medium Density; Manufacturer Part Number: AP2112K-3.3; Pin Count: 5; Case: SOT25; Mounted: Yes; Socket: No; SMD: Yes; Sense: No; ComponentHeight: 1.4mm; HelpURL: \\cern.ch\dfs\Applications\Altium\Datasheets\AP2112K-3.3TRG1.pdf; Author: CERN DEM MR; CreateDate: 13.12.2017; LatestRevisionDate: 27.06.2022
J4 J10 = PCB Edge Connector 12 (2x6): Part Number: EDGE10T1B6_P200W1000L0F100X400; Part Description: 10 Contacts Board Edge Connector, Pitch 2mm, Length 0mm, Width 10mm, Finger Lenght 4mm, Finger Width 1mm; Mounted: No; PressFit: No; Component Kind: Standard (No BOM); Component Type: Standard (No BOM); Pin Count: 12; Socket: No; SMD: No; Sense: No; Status: None; ComponentHeight: 0mm; HelpURL: \\cern.ch\dfs\Applications\Altium\Datasheets\EDGE10T1B6_P200W1000L0F100X400.pdf; Author: CERN DEM MR; CreateDate: 14.02.2018; LatestRevisionDate: 14.02.2018
J9 J11 = PCB Edge Connector 12 (2x6) R: PCB Edge Connector 12 (2x6); Part Description: 12 Contacts Board Edge Connector, Pitch 2mm, Length 0mm, Width 10mm, Finger Lenght 4mm, Finger Width 1mm; Mounted: No; PressFit: No; Part Number: EDGE12T5B10_P200W1000L0F100X400; Component Kind: Standard (No BOM); Component Type: Standard (No BOM); Pin Count: 12; Socket: No; SMD: No; Sense: No; Status: None; ComponentHeight: 0mm; HelpURL: \\cern.ch\dfs\Applications\Altium\Datasheets\EDGE10T5B10_P200W1000L0F100X400.pdf; Author: GK; CreateDate: 14.02.2018; LatestRevisionDate: 14.02.2018
J9R J100 = EDGE10T5B10_P200W1000L0F100X400: PCB Edge Connector 10 (2x5); Part Description: 10 Contacts Board Edge Connector, Pitch 2mm, Length 0mm, Width 10mm, Finger Lenght 4mm, Finger Width 1mm; Mounted: No; PressFit: No; Part Number: EDGE10T5B10_P200W1000L0F100X400; Component Kind: Standard (No BOM); Component Type: Standard (No BOM); Pin Count: 10; Socket: No; SMD: No; Sense: No; Status: None; ComponentHeight: 0mm; HelpURL: \\cern.ch\dfs\Applications\Altium\Datasheets\EDGE10T5B10_P200W1000L0F100X400.pdf; Author: CERN DEM MR; CreateDate: 14.02.2018; LatestRevisionDate: 14.02.2018
J11L J12 = EDGE10T1B6_P200W1000L0F100X400: PCB Edge Connector 10 (2x5); Part Description: 10 Contacts Board Edge Connector, Pitch 2mm, Length 0mm, Width 10mm, Finger Lenght 4mm, Finger Width 1mm; Mounted: No; PressFit: No; Part Number: EDGE10T1B6_P200W1000L0F100X400; Component Kind: Standard (No BOM); Component Type: Standard (No BOM); Pin Count: 10; Socket: No; SMD: No; Sense: No; Status: None; ComponentHeight: 0mm; HelpURL: \\cern.ch\dfs\Applications\Altium\Datasheets\EDGE10T1B6_P200W1000L0F100X400.pdf; Author: CERN DEM MR; CreateDate: 14.02.2018; LatestRevisionDate: 14.02.2018
J13 = TC2050-IDC: TC2030-MCP and TC2050-IDC Pad Contact; Part Description: 10 X 31mil Diameter SMD Pad For TC2050-IDC Legged Connector; Mounted: No; Part Number: TC2050-IDC; Component Kind: Standard (No BOM); Component Type: Standard (No BOM); Pin Count: 10; Family: TC2050-IDC; Socket: No; SMD: Yes; Sense: No; Status: None; ComponentHeight: 0mm; HelpURL: \\cern.ch\dfs\Applications\Altium\Datasheets\TC2050-IDC.pdf; Author: CERN DEM HF; CreateDate: 02.05.2024; LatestRevisionDate: 02.05.2024; PackageDescription: 10 X 31mil Diameter SMD Pad For TC2030-MCP Legged Connector
J98 J99 = AVX_009159012761916: Open Ended Card Edge Connector, 9159 Series; Part Number: AVX_0009159012761916; Part Description: 10 Contacts, 2mm Pitch, Open Ended Card Edge Connector, 9159 Series; Manufacturer: AVX; PressFit: No; Component Kind: Standard; Component Type: Standard; Pin Count: 12; Mounted: Yes; Socket: No; SMD: No; Sense: No; Status: None; Manufacturer Part Number: 009159012761916; ComponentHeight: 1.6mm; HelpURL: \\cern.ch\dfs\Applications\Altium\Datasheets\AVX_00 9159 010 061 916.pdf; Author: GK; CreateDate: 13.02.2018; LatestRevisionDate: 13.02.2018
LD1 LD18-LD21 = LED_KINGBRIGHT_KP-1608CGCK: as LD2 on sheet MODULIQ_PGA; Part Number: LED_KINGBRIGHT_KP-1608CGCK; Component Kind: Standard; Component Type: Standard; Color: Green; PackageDescription: SMT Green LED, Case 0603, Body L 1.60mm x W 0.80mm x H 1.10mm; Manufacturer: KINGBRIGHT; Manufacturer Part Number: KP-1608CGCK; Pin Count: 2; Case: 0603; Mounted: Yes; Socket: No; SMD: Yes; Sense: No; ComponentHeight: 1.1mm; HelpURL: \\cern.ch\dfs\Applications\Altium\Datasheets\LED_KINGBRIGHT_KP-1608CGCK.pdf; Author: CERN DEM HF; CreateDate: 01.10.2021; LatestRevisionDate: 01.10.2021
MP1-MP4 = 97730306330R: WA-SMSI SMT Steel Spacer with internal Thread Bottom closed, OD 3.3mm, M1.6 x 3mm; Manufacturer: Wurth Elektronik; Inside Thread Length: 1.8mm; Surface: Tin; ComponentLink1Description: Website Link; ComponentLink1URL: https://www.we-online.com/redexpert/article/97730306330R?ad; ComponentLink2Description: Datasheet Link; ComponentLink2URL: https://www.we-online.com/redexpert/spec/97730306330R?ad; Manufacturer Part Number: 97730306330R; Category: SMT Spacers; Match Code: WA-SMSI; Mount: Surface Mount; Operating Temperature Max: 150°C; Operating Temperature Min: -55°C; Packaging: Tape and Reel; Height: 3mm; Material: Steel; Outside Diameter: 3.3mm; Thread Size: M1.6
NT1-NT12 = Net Tie 3: Part Description: Net Tie (2 Nets); Mounted: No; Part Number: Net Tie 3; Component Type: Net Tie; Pin Count: 2; Family: Net Tie; Socket: No; SMD: No; Sense: No; Status: None; ComponentHeight: 0mm; HelpURL: Undefined; Author: CERN DEM HF; CreateDate: 23.09.2024; LatestRevisionDate: 23.09.2024; PackageDescription: SMD Net Tie
R26 R27 R32-R34 = R0402_3K3_1%_0.0625W_100PPM: as R52 on sheet MODULIQ_PGA; Part Number: R0402_3K3_1%_0.0625W_100PPM; Component Kind: Standard; Component Type: Standard; Pin Count: 2; Value: 3k3; Status: Not Recommended; Power: 0.0625W; Manufacturer Part Number: R0402_3K3_1%_0.0625W_100PPM; Case: 0402; Mounted: Yes; Sense: No; Socket: No; SMD: Yes; Manufacturer1 Example: YAGEO PHYCOMP; Manufacturer1 ComponentHeight: 0.4mm; HelpURL: \\cern.ch\dfs\Applications\Altium\Datasheets\R0402_Phycomp_RC0402.pdf; Author: CERN DEM JLC; CreateDate: 03.12.2007; LatestRevisionDate: 17.10.2012
SW2 = SW_OMRON_A6H-4102: 4 Ways SPST DIP Switch; Part Description: 4 Ways Ultra-low Profile, Half-pitch, SPST DIP Switch with Seal Tape, Rating 25mA 24VDC; Manufacturer: OMRON; PressFit: No; Part Number: SW_OMRON_A6H-4102; Component Kind: Standard; Component Type: Standard; Pin Count: 8; PackageDescription: Pitch 1.27mm, Body 6.31 x 4.5mm, 4 Ways SPST Surface-Mounting DIP Switch, OMRON A6H; Family: Switch; Mounted: Yes; Socket: No; SMD: Yes; Sense: No; Status: None; Manufacturer Part Number: A6H-4102; ComponentHeight: 1.45mm; HelpURL: \\cern.ch\dfs\Applications\Altium\Datasheets\SW_OMRON_A6H-4102.pdf; Author: CERN DEM JLC; CreateDate: 17.12.2013; LatestRevisionDate: 17.12.2013